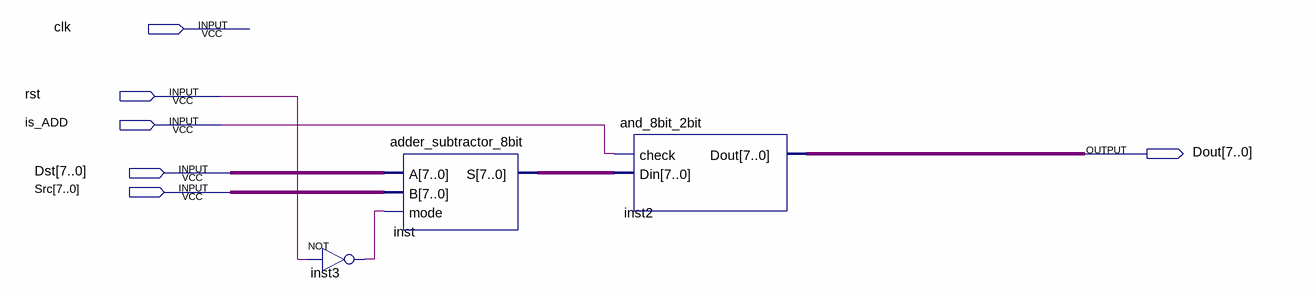
[diagram p0: schematic sheet]
// Quartus schematic add_module.bdf as structural Verilog: 3 symbols, 6 pins
module add_module (
  input  clk,
  input  rst,
  input  is_ADD,
  input  [7:0] Dst,
  input  [7:0] Src,
  output [7:0] Dout
);

  wire inst3_out;
  wire [7:0] inst_s;

  not inst3 (inst3_out, rst);
  adder_subtractor_8bit inst (.A(Dst), .B(Src), .mode(inst3_out), .S(inst_s));
  and_8bit_2bit inst2 (.check(is_ADD), .Din(inst_s), .Dout(Dout));
endmodule
